# Altium schematic sheet ESP32_S2_solo.SchDoc
size A4; Engineer: Naif Aljohani; DocumentNumber: 3; Revision: v1.0; SheetNumber: 3; SheetTotal: 6; SPICEModelCacheSFRKXKUM: <root> / <DocumentId>SFRKXKUM</DocumentId> / </root>
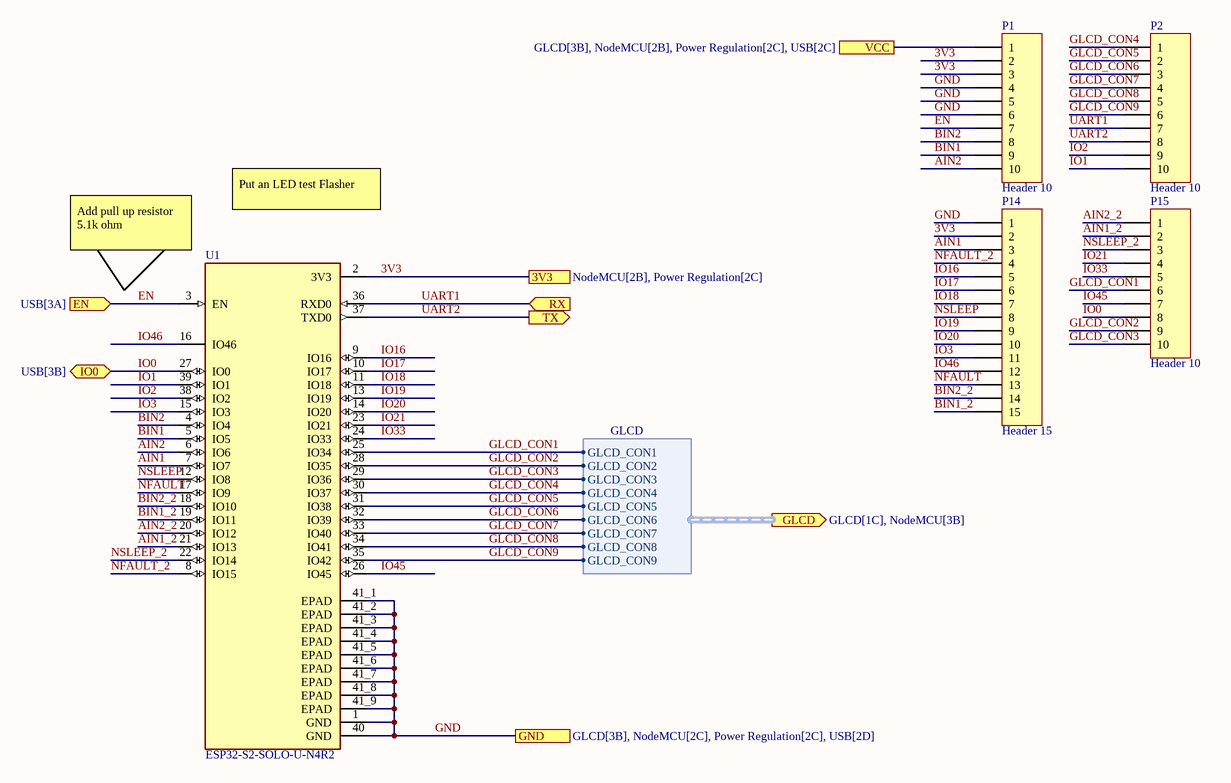
[diagram p0: ESP32_S2_solo.SchDoc]

## Parts
P1  Header 10  [HDR1X10]
P2  Header 10  [HDR1X10]
P14  Header 15  [HDR1X15]
P15  Header 10  [HDR1X10]
U1  ESP32-S2-SOLO-U-N4R2  [XCVR_ESP32-S2-SOLO-U-N4R2]

## Ports
3V3 (see NodeMCU[2B], Power Regulation[2C]), EN (in, see USB[3A]), GLCD (out, harness GLCD, see GLCD[1C], NodeMCU[3B]), GND (see GLCD[3B], NodeMCU[2C], Power Regulation[2C], USB[2D]), IO0 (bidir, see USB[3B]), RX (in), TX (out), VCC (see GLCD[3B], NodeMCU[2B], Power Regulation[2C], USB[2C])

## Harnesses
GLCD: GLCD_CON1, GLCD_CON2, GLCD_CON3, GLCD_CON4, GLCD_CON5, GLCD_CON6, GLCD_CON7, GLCD_CON8, GLCD_CON9

## Nets
3V3: P1.2 P1.3 P14.2 U1.2(3V3) ; port 3V3
AIN1: P14.3 U1.7(IO7)
AIN1_2: P15.2 U1.21(IO13)
AIN2: P1.10 U1.6(IO6)
AIN2_2: P15.1 U1.20(IO12)
BIN1: P1.9 U1.5(IO5)
BIN1_2: P14.15 U1.19(IO11)
BIN2: P1.8 U1.4(IO4)
BIN2_2: P14.14 U1.18(IO10)
EN: P1.7 U1.3(EN) ; port EN
GLCD_CON1: P15.6 U1.25(IO34) ; port GLCD.GLCD_CON1
GLCD_CON2: P15.9 U1.28(IO35) ; port GLCD.GLCD_CON2
GLCD_CON3: P15.10 U1.29(IO36) ; port GLCD.GLCD_CON3
GLCD_CON4: P2.1 U1.30(IO37) ; port GLCD.GLCD_CON4
GLCD_CON5: P2.2 U1.31(IO38) ; port GLCD.GLCD_CON5
GLCD_CON6: P2.3 U1.32(IO39) ; port GLCD.GLCD_CON6
GLCD_CON7: P2.4 U1.33(IO40) ; port GLCD.GLCD_CON7
GLCD_CON8: P2.5 U1.34(IO41) ; port GLCD.GLCD_CON8
GLCD_CON9: P2.6 U1.35(IO42) ; port GLCD.GLCD_CON9
GND: P1.4 P1.5 P1.6 P14.1 U1.1(GND) U1.40(GND) U1.41_1(EPAD) U1.41_2(EPAD) U1.41_3(EPAD) U1.41_4(EPAD) U1.41_5(EPAD) U1.41_6(EPAD) U1.41_7(EPAD) U1.41_8(EPAD) U1.41_9(EPAD) ; port GND
IO0: P15.8 U1.27(IO0) ; port IO0
IO1: P2.10 U1.39(IO1)
IO2: P2.9 U1.38(IO2)
IO3: P14.11 U1.15(IO3)
IO16: P14.5 U1.9(IO16)
IO17: P14.6 U1.10(IO17)
IO18: P14.7 U1.11(IO18)
IO19: P14.9 U1.13(IO19)
IO20: P14.10 U1.14(IO20)
IO21: P15.4 U1.23(IO21)
IO33: P15.5 U1.24(IO33)
IO45: P15.7 U1.26(IO45)
IO46: P14.12 U1.16(IO46)
NFAULT: P14.13 U1.17(IO9)
NFAULT_2: P14.4 U1.8(IO15)
NSLEEP: P14.8 U1.12(IO8)
NSLEEP_2: P15.3 U1.22(IO14)
UART1: P2.7 U1.36(RXD0) ; port RX
UART2: P2.8 U1.37(TXD0) ; port TX
VCC: P1.1 ; port VCC

## Notes on the sheet
- Put an LED test Flasher
- (near U1) Add pull up resistor 5.1k ohm

## Library data of the parts
P1 P2 P15 = Header 10: Header, 10-Pin; LatestRevisionDate: 17-Jul-2002; LatestRevisionNote: Re-released for DXP Platform.; Publisher: Altium Limited
P14 = Header 15: Header, 15-Pin; LatestRevisionDate: 17-Jul-2002; LatestRevisionNote: Re-released for DXP Platform.; Publisher: Altium Limited
U1 = ESP32-S2-SOLO-U-N4R2: MF: {'manufacturer': u'Espressif Systems'}; Package: None; Price: None; MP: ESP32-S2-SOLO-U-N4R2; Availability: Unavailable; Value: *